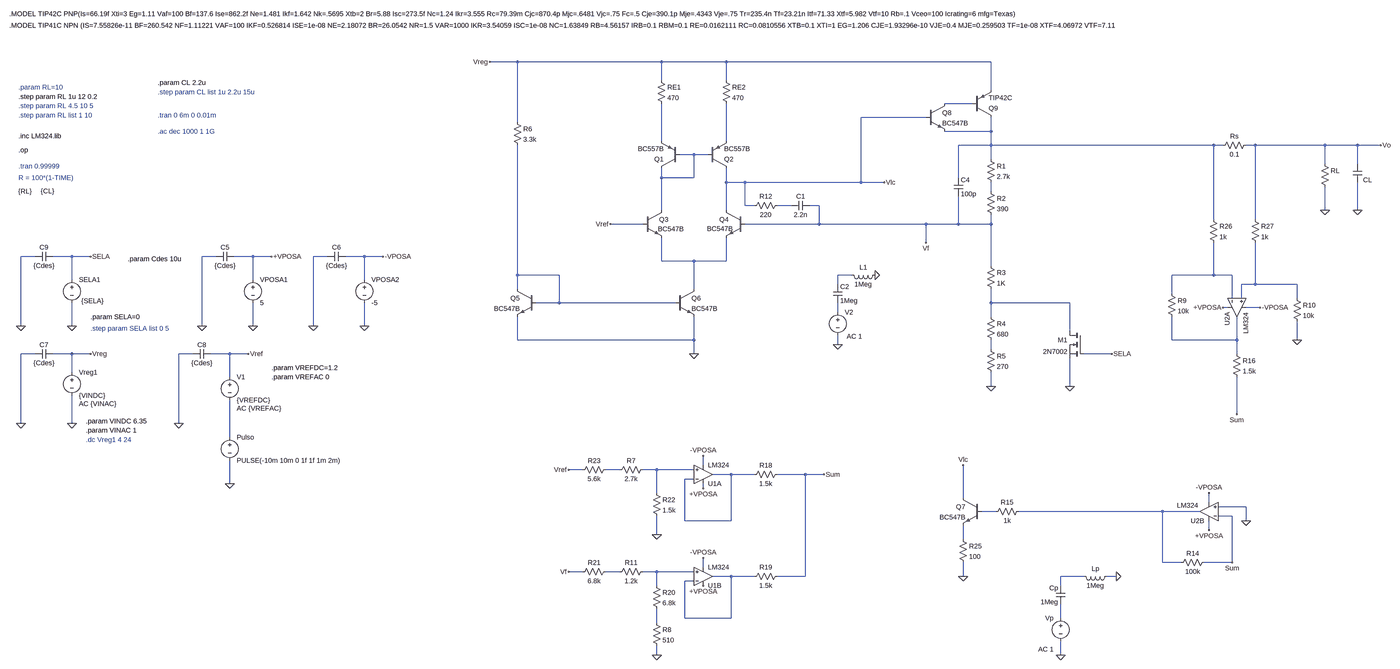
[diagram p0: schematic Simulación.asc, whole sheet]
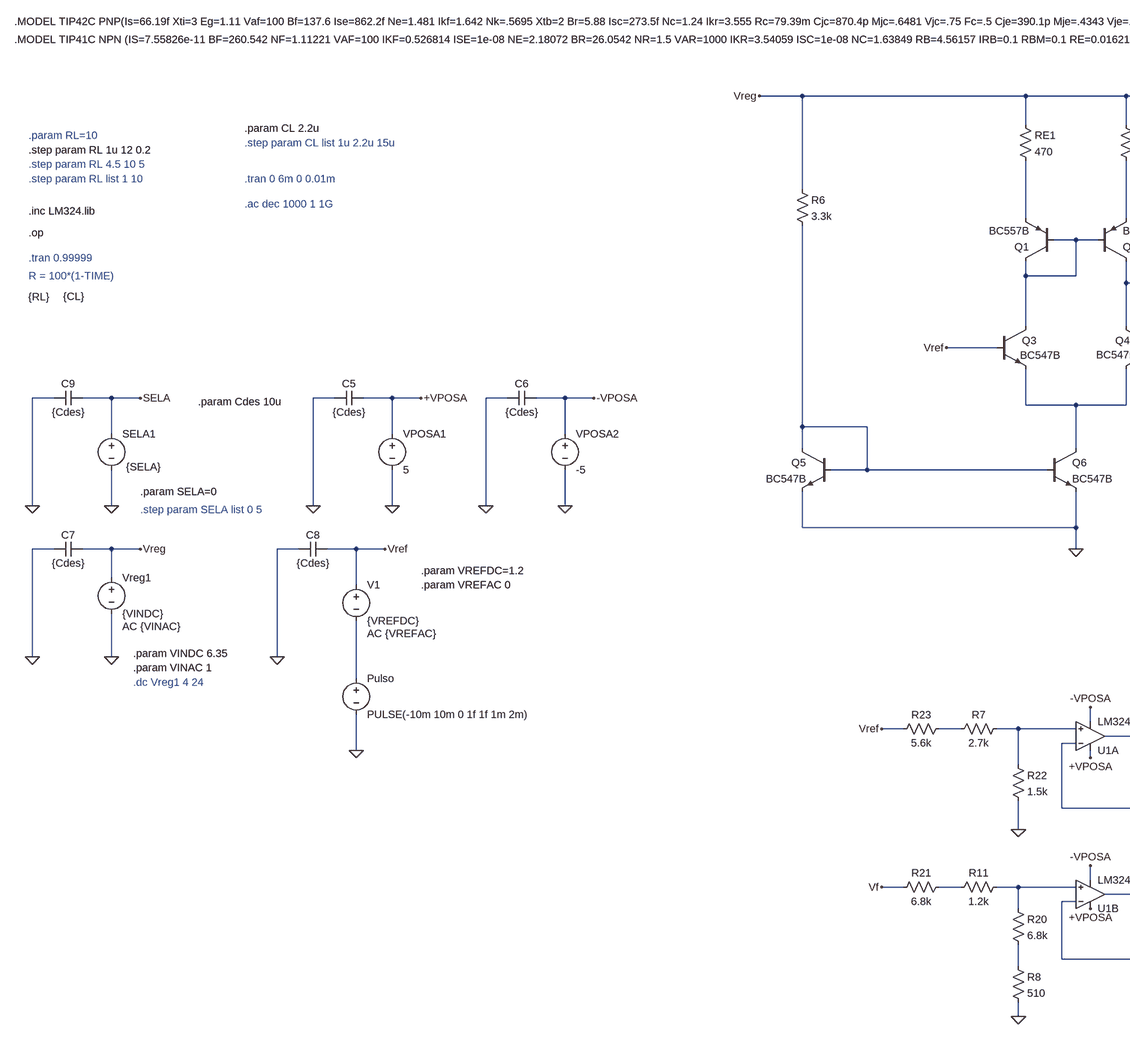
[diagram p1: schematic Simulación.asc, part, row 1 of 1, column 1 of 2]
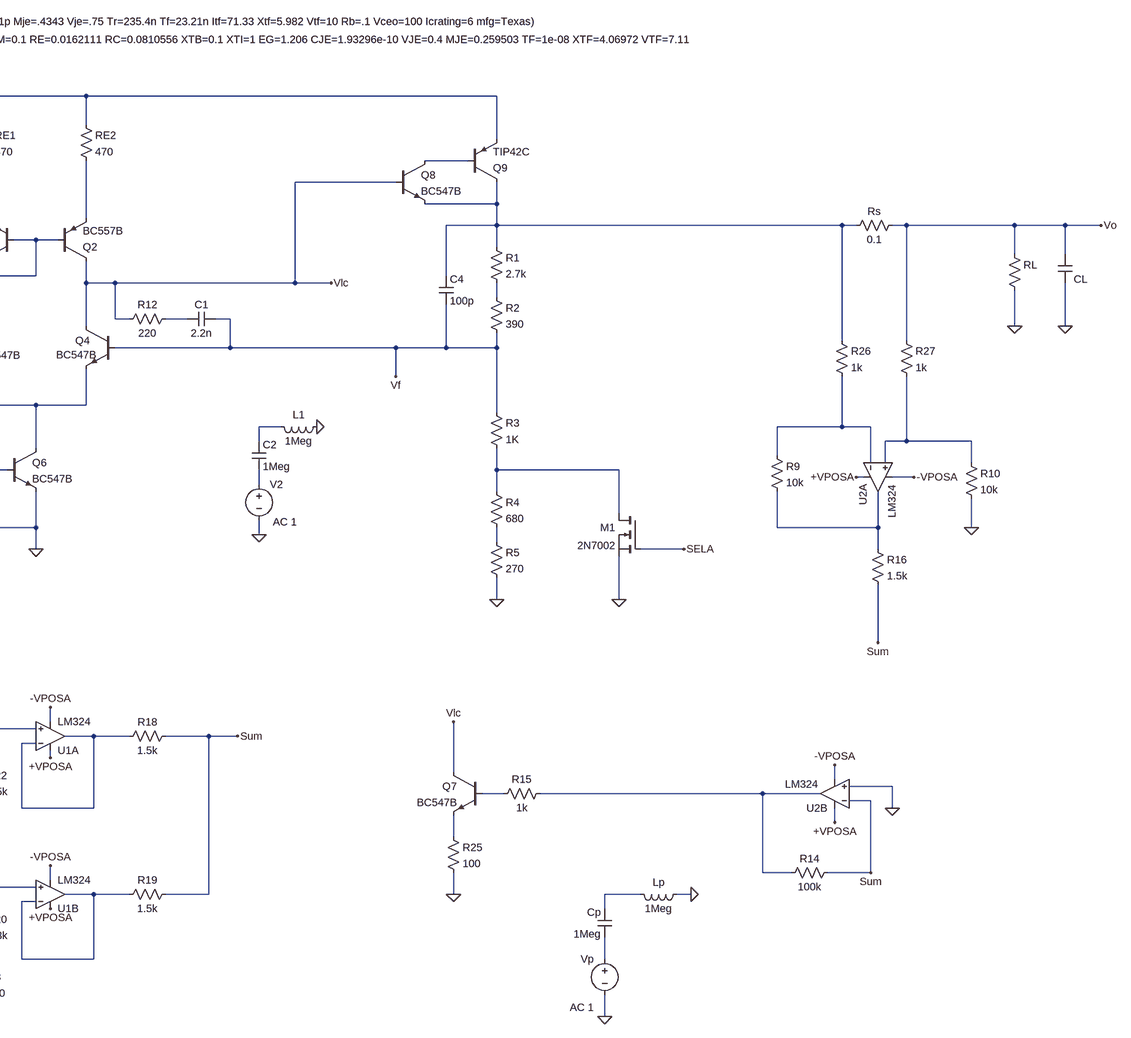
[diagram p2: schematic Simulación.asc, part, row 1 of 1, column 2 of 2]
Simulación.asc, the LTspice schematic file:
Version 4
SHEET 1 10276 2836
WIRE -160 -288 -256 -288
WIRE 336 -288 -160 -288
WIRE 560 -288 336 -288
WIRE 1472 -288 560 -288
WIRE 336 -224 336 -288
WIRE 560 -224 560 -288
WIRE 1472 -192 1472 -288
WIRE 1408 -144 1312 -144
WIRE 1248 -96 1024 -96
WIRE -160 -80 -160 -288
WIRE 1472 -48 1472 -96
WIRE 1472 -48 1312 -48
WIRE 336 -16 336 -144
WIRE 560 -16 560 -144
WIRE 1472 0 1472 -48
WIRE 1472 0 1360 0
WIRE 2336 0 1472 0
WIRE 2368 0 2336 0
WIRE 2480 0 2448 0
WIRE 2720 0 2480 0
WIRE 2832 0 2720 0
WIRE 2912 0 2832 0
WIRE 448 32 400 32
WIRE 496 32 448 32
WIRE 1472 48 1472 0
WIRE 2720 64 2720 0
WIRE 2832 64 2832 0
WIRE 336 112 336 80
WIRE 448 112 448 32
WIRE 448 112 336 112
WIRE 1360 112 1360 0
WIRE 560 128 560 80
WIRE 624 128 560 128
WIRE 1024 128 1024 -96
WIRE 1024 128 624 128
WIRE 1104 128 1024 128
WIRE 1472 160 1472 128
WIRE 624 208 624 128
WIRE 656 208 624 208
WIRE 784 208 736 208
WIRE 880 208 848 208
WIRE 336 224 336 112
WIRE 560 224 560 128
WIRE 2720 224 2720 144
WIRE 2832 224 2832 128
WIRE 2336 256 2336 0
WIRE 2480 256 2480 0
WIRE 272 272 160 272
WIRE 880 272 880 208
WIRE 880 272 624 272
WIRE 1248 272 880 272
WIRE 1360 272 1360 176
WIRE 1360 272 1248 272
WIRE 1472 272 1472 240
WIRE 1472 272 1360 272
WIRE 1248 336 1248 272
WIRE -1824 384 -1872 384
WIRE -1696 384 -1760 384
WIRE -1632 384 -1696 384
WIRE -1200 384 -1248 384
WIRE -1072 384 -1136 384
WIRE -1008 384 -1072 384
WIRE -816 384 -864 384
WIRE -688 384 -752 384
WIRE -624 384 -688 384
WIRE 336 400 336 320
WIRE 448 400 336 400
WIRE 560 400 560 320
WIRE 560 400 448 400
WIRE 1472 416 1472 272
WIRE -160 448 -160 0
WIRE -16 448 -160 448
WIRE 992 448 944 448
WIRE 2336 448 2336 336
WIRE 2336 448 2192 448
WIRE 2400 448 2336 448
WIRE -1696 464 -1696 384
WIRE -1072 464 -1072 384
WIRE -688 464 -688 384
WIRE 944 480 944 448
WIRE 2480 480 2480 336
WIRE 2480 480 2432 480
WIRE 2624 480 2480 480
WIRE -160 496 -160 448
WIRE 448 496 448 400
WIRE 2192 512 2192 448
WIRE 2400 528 2400 448
WIRE 2432 528 2432 480
WIRE 2624 528 2624 480
WIRE -16 544 -16 448
WIRE -16 544 -96 544
WIRE 384 544 -16 544
WIRE 1472 544 1472 496
WIRE 1744 544 1472 544
WIRE 2384 560 2368 560
WIRE 2496 560 2448 560
WIRE 944 576 944 544
WIRE 1472 592 1472 544
WIRE -1872 624 -1872 384
WIRE -1696 624 -1696 544
WIRE -1248 624 -1248 384
WIRE -1072 624 -1072 544
WIRE -864 624 -864 384
WIRE -688 624 -688 544
WIRE 1744 640 1744 544
WIRE -160 672 -160 592
WIRE 448 672 448 592
WIRE 448 672 -160 672
WIRE 2192 672 2192 592
WIRE 2416 672 2416 592
WIRE 2416 672 2192 672
WIRE 2624 672 2624 608
WIRE 944 688 944 656
WIRE 1472 704 1472 672
WIRE -1824 720 -1872 720
WIRE -1696 720 -1760 720
WIRE -1632 720 -1696 720
WIRE -1280 720 -1328 720
WIRE -1152 720 -1216 720
WIRE -1088 720 -1152 720
WIRE 448 720 448 672
WIRE 1888 720 1792 720
WIRE 2416 720 2416 672
WIRE -1696 784 -1696 720
WIRE -1152 800 -1152 720
WIRE 1472 832 1472 784
WIRE 1744 832 1744 736
WIRE 2416 928 2416 800
WIRE -1872 960 -1872 720
WIRE -1696 960 -1696 864
WIRE -1328 960 -1328 720
WIRE -1152 1008 -1152 880
WIRE 480 1104 480 1072
WIRE 64 1120 16 1120
WIRE 192 1120 144 1120
WIRE 320 1120 272 1120
WIRE 448 1120 320 1120
WIRE 576 1136 512 1136
WIRE 656 1136 576 1136
WIRE 832 1136 736 1136
WIRE 896 1136 832 1136
WIRE 448 1152 416 1152
WIRE -1152 1168 -1152 1088
WIRE 480 1184 480 1168
WIRE 320 1200 320 1120
WIRE 1376 1216 1376 1104
WIRE 2320 1232 2320 1200
WIRE 2448 1248 2352 1248
WIRE 1488 1264 1440 1264
WIRE 2160 1264 1568 1264
WIRE 2288 1264 2160 1264
WIRE 2400 1280 2352 1280
WIRE 416 1296 416 1152
WIRE 576 1296 576 1136
WIRE 576 1296 416 1296
WIRE 2448 1296 2448 1248
WIRE 2320 1328 2320 1296
WIRE 320 1344 320 1280
WIRE 1376 1360 1376 1312
WIRE 2160 1440 2160 1264
WIRE 2224 1440 2160 1440
WIRE 2400 1440 2400 1280
WIRE 2400 1440 2304 1440
WIRE 480 1456 480 1424
WIRE 64 1472 16 1472
WIRE 192 1472 144 1472
WIRE 320 1472 272 1472
WIRE 448 1472 320 1472
WIRE 576 1488 512 1488
WIRE 656 1488 576 1488
WIRE 832 1488 832 1136
WIRE 832 1488 736 1488
WIRE 1376 1488 1376 1440
WIRE 1792 1488 1712 1488
WIRE 1904 1488 1872 1488
WIRE 448 1504 416 1504
WIRE 320 1520 320 1472
WIRE 1712 1520 1712 1488
WIRE 416 1632 416 1504
WIRE 576 1632 576 1488
WIRE 576 1632 416 1632
WIRE 1712 1632 1712 1584
WIRE 320 1648 320 1600
WIRE 320 1760 320 1728
WIRE 1712 1760 1712 1712
FLAG 1248 336 Vf
FLAG 1376 1488 0
FLAG 320 1344 0
FLAG 320 1760 0
FLAG 2720 224 0
FLAG 2832 224 0
FLAG 480 1184 +VPOSA
FLAG 2368 560 +VPOSA
FLAG 2320 1328 +VPOSA
FLAG 480 1520 +VPOSA
FLAG -1696 960 0
FLAG 1744 832 0
FLAG 1472 832 0
FLAG -1696 624 0
FLAG 448 720 0
FLAG -1072 624 0
FLAG -1008 384 +VPOSA
FLAG 160 272 Vref
FLAG 16 1472 Vf
FLAG 16 1120 Vref
FLAG 2400 1440 Sum
FLAG 1376 1104 Vlc
FLAG 1104 128 Vlc
FLAG 896 1136 Sum
FLAG -256 -288 Vreg
FLAG -1632 720 Vreg
FLAG 1888 720 SELA
FLAG -1632 384 SELA
FLAG 2912 0 Vo
FLAG 2416 928 Sum
FLAG -688 624 0
FLAG -624 384 -VPOSA
FLAG 2624 672 0
FLAG 2496 560 -VPOSA
FLAG 480 1072 -VPOSA
FLAG 480 1424 -VPOSA
FLAG 2320 1200 -VPOSA
FLAG 2448 1296 0
FLAG 1712 1760 0
FLAG -1088 720 Vref
FLAG -1152 1168 0
FLAG 944 688 0
FLAG -1248 624 0
FLAG -864 624 0
FLAG -1872 960 0
FLAG -1328 960 0
FLAG -1872 624 0
FLAG 1072 448 0
FLAG 1904 1488 0
SYMBOL pnp 400 80 R180
SYMATTR InstName Q1
SYMATTR Value BC557B
SYMBOL pnp 496 80 M180
SYMATTR InstName Q2
SYMATTR Value BC557B
SYMBOL npn 272 224 R0
WINDOW 3 52 65 Left 2
SYMATTR Value BC547B
SYMATTR InstName Q3
SYMBOL npn 624 224 M0
WINDOW 3 42 64 Left 2
SYMATTR Value BC547B
SYMATTR InstName Q4
SYMBOL pnp 1408 -96 M180
SYMATTR InstName Q9
SYMATTR Value TIP42C
SYMBOL npn 1248 -144 R0
SYMATTR InstName Q8
SYMATTR Value BC547B
SYMBOL res 1456 144 R0
SYMATTR InstName R2
SYMATTR Value 390
SYMBOL res 1456 400 R0
SYMATTR InstName R3
SYMATTR Value 1K
SYMBOL res 2704 48 R0
WINDOW 3 -4585 111 Left 2
SYMATTR Value {RL}
SYMATTR InstName RL
SYMBOL voltage -1152 784 R0
WINDOW 123 24 124 Left 2
WINDOW 39 0 0 Left 0
SYMATTR Value2 AC {VREFAC}
SYMATTR InstName V1
SYMATTR Value {VREFDC}
SYMBOL voltage -1696 768 R0
WINDOW 123 24 124 Left 2
WINDOW 39 0 0 Left 0
SYMATTR Value2 AC {VINAC}
SYMATTR InstName Vreg1
SYMATTR Value {VINDC}
SYMBOL res 320 -240 R0
SYMATTR InstName RE1
SYMATTR Value 470
SYMBOL res 544 -240 R0
SYMATTR InstName RE2
SYMATTR Value 470
SYMBOL cap 2816 64 R0
WINDOW 0 35 56 Left 2
WINDOW 3 -4620 94 Left 2
SYMATTR InstName CL
SYMATTR Value {CL}
SYMBOL res 2464 -16 R90
WINDOW 0 0 56 VBottom 2
WINDOW 3 32 56 VTop 2
SYMATTR InstName Rs
SYMATTR Value 0.1
SYMBOL res 2320 1424 R90
WINDOW 0 0 56 VBottom 2
WINDOW 3 32 56 VTop 2
SYMATTR InstName R14
SYMATTR Value 100k
SYMBOL res 1584 1248 R90
WINDOW 0 0 56 VBottom 2
WINDOW 3 32 56 VTop 2
SYMATTR InstName R15
SYMATTR Value 1k
SYMBOL res 1360 1344 R0
SYMATTR InstName R25
SYMATTR Value 100
SYMBOL npn 1440 1216 M0
SYMATTR InstName Q7
SYMATTR Value BC547B
SYMBOL res 304 1184 R0
SYMATTR InstName R22
SYMATTR Value 1.5k
SYMBOL res 752 1120 R90
WINDOW 0 0 56 VBottom 2
WINDOW 3 32 56 VTop 2
SYMATTR InstName R18
SYMATTR Value 1.5k
SYMBOL res 160 1456 R90
WINDOW 0 0 56 VBottom 2
WINDOW 3 32 56 VTop 2
SYMATTR InstName R21
SYMATTR Value 6.8k
SYMBOL res 304 1504 R0
SYMATTR InstName R20
SYMATTR Value 6.8k
SYMBOL res 752 1472 R90
WINDOW 0 0 56 VBottom 2
WINDOW 3 32 56 VTop 2
SYMATTR InstName R19
SYMATTR Value 1.5k
SYMBOL res 1456 576 R0
SYMATTR InstName R4
SYMATTR Value 680
SYMBOL nmos 1792 640 M0
SYMATTR InstName M1
SYMATTR Value 2N7002
SYMBOL voltage -1696 448 R0
WINDOW 3 32 89 Left 2
WINDOW 123 0 0 Left 0
WINDOW 39 0 0 Left 0
SYMATTR Value {SELA}
SYMATTR InstName SELA1
SYMBOL npn 384 496 R0
SYMATTR InstName Q6
SYMATTR Value BC547B
SYMBOL npn -96 496 M0
SYMATTR InstName Q5
SYMATTR Value BC547B
SYMBOL res -176 -96 R0
SYMATTR InstName R6
SYMATTR Value 3.3k
SYMBOL res 1456 32 R0
SYMATTR InstName R1
SYMATTR Value 2.7k
SYMBOL OpAmps\\opamp2 2352 560 M90
SYMATTR InstName U2A
SYMATTR Value LM324
SYMBOL OpAmps\\opamp2 2320 1328 R180
WINDOW 3 36 85 Left 2
SYMATTR Value LM324
SYMATTR InstName U2B
SYMBOL OpAmps\\opamp2 480 1200 M180
SYMATTR InstName U1A
SYMATTR Value LM324
SYMBOL voltage -1072 448 R0
SYMATTR InstName VPOSA1
SYMATTR Value 5
SYMBOL res 160 1104 R90
WINDOW 0 0 56 VBottom 2
WINDOW 3 32 56 VTop 2
SYMATTR InstName R23
SYMATTR Value 5.6k
SYMBOL res 2608 512 R0
SYMATTR InstName R10
SYMATTR Value 10k
SYMBOL res 2320 240 R0
SYMATTR InstName R26
SYMATTR Value 1k
SYMBOL res 2464 240 R0
SYMATTR InstName R27
SYMATTR Value 1k
SYMBOL res 1456 688 R0
SYMATTR InstName R5
SYMATTR Value 270
SYMBOL OpAmps\\opamp2 480 1552 M180
SYMATTR InstName U1B
SYMATTR Value LM324
SYMBOL res 288 1104 R90
WINDOW 0 0 56 VBottom 2
WINDOW 3 32 56 VTop 2
SYMATTR InstName R7
SYMATTR Value 2.7k
SYMBOL voltage -1152 992 R0
WINDOW 123 0 0 Left 0
WINDOW 39 0 0 Left 0
SYMATTR InstName Pulso
SYMATTR Value PULSE(-10m 10m 0 1f 1f 1m 2m)
SYMBOL res 2400 704 R0
SYMATTR InstName R16
SYMATTR Value 1.5k
SYMBOL voltage -688 448 R0
SYMATTR InstName VPOSA2
SYMATTR Value -5
SYMBOL res 2176 496 R0
SYMATTR InstName R9
SYMATTR Value 10k
SYMBOL res 304 1632 R0
SYMATTR InstName R8
SYMATTR Value 510
SYMBOL res 288 1456 R90
WINDOW 0 0 56 VBottom 2
WINDOW 3 32 56 VTop 2
SYMATTR InstName R11
SYMATTR Value 1.2k
SYMBOL cap 1728 1520 M0
SYMATTR InstName Cp
SYMATTR Value 1Meg
SYMBOL voltage 1712 1616 M0
WINDOW 123 24 124 Left 2
WINDOW 39 0 0 Left 0
WINDOW 3 24 44 Left 2
SYMATTR Value2 AC 1
SYMATTR Value ""
SYMATTR InstName Vp
SYMBOL ind 1776 1472 M90
WINDOW 0 5 56 VBottom 2
WINDOW 3 32 56 VTop 2
SYMATTR InstName Lp
SYMATTR Value 1Meg
SYMBOL cap 1344 112 R0
SYMATTR InstName C4
SYMATTR Value 100p
SYMBOL cap 848 192 R90
WINDOW 0 0 32 VBottom 2
WINDOW 3 32 32 VTop 2
SYMATTR InstName C1
SYMATTR Value 2.2n
SYMBOL res 752 192 R90
WINDOW 0 0 56 VBottom 2
WINDOW 3 32 56 VTop 2
SYMATTR InstName R12
SYMATTR Value 220
SYMBOL ind 1088 432 R90
WINDOW 0 5 56 VBottom 2
WINDOW 3 32 56 VTop 2
SYMATTR InstName L1
SYMATTR Value 1Meg
SYMBOL cap 928 480 R0
SYMATTR InstName C2
SYMATTR Value 1Meg
SYMBOL voltage 944 560 R0
WINDOW 3 24 152 Left 2
WINDOW 123 31 100 Left 2
WINDOW 39 0 0 Left 0
SYMATTR Value ""
SYMATTR Value2 AC 1
SYMATTR InstName V2
SYMBOL cap -1200 400 R270
WINDOW 0 32 32 VTop 2
WINDOW 3 0 32 VBottom 2
SYMATTR InstName C5
SYMATTR Value {Cdes}
SYMBOL cap -816 400 R270
WINDOW 0 32 32 VTop 2
WINDOW 3 0 32 VBottom 2
SYMATTR InstName C6
SYMATTR Value {Cdes}
SYMBOL cap -1824 736 R270
WINDOW 0 32 32 VTop 2
WINDOW 3 0 32 VBottom 2
SYMATTR InstName C7
SYMATTR Value {Cdes}
SYMBOL cap -1280 736 R270
WINDOW 0 32 32 VTop 2
WINDOW 3 0 32 VBottom 2
SYMATTR InstName C8
SYMATTR Value {Cdes}
SYMBOL cap -1824 400 R270
WINDOW 0 32 32 VTop 2
WINDOW 3 0 32 VBottom 2
SYMATTR InstName C9
SYMATTR Value {Cdes}
TEXT -1880 16 Left 2 !.op
TEXT -1648 952 Left 2 !.param VINDC 6.35
TEXT -1648 984 Left 2 !.param VINAC 1
TEXT -1008 768 Left 2 !.param VREFDC=1.2
TEXT -1008 800 Left 2 !.param VREFAC 0
TEXT -1880 -200 Left 2 ;.param RL=10
TEXT -1648 1016 Left 2 ;.dc Vreg1 4 24
TEXT -1880 -168 Left 2 !.step param RL 1u 12 0.2
TEXT -1912 -544 Left 2 !.MODEL TIP42C PNP(Is=66.19f Xti=3 Eg=1.11 Vaf=100 Bf=137.6 Ise=862.2f Ne=1.481 Ikf=1.642 Nk=.5695 Xtb=2 Br=5.88 Isc=273.5f Nc=1.24 Ikr=3.555 Rc=79.39m Cjc=870.4p Mjc=.6481 Vjc=.75 Fc=.5 Cje=390.1p Mje=.4343 Vje=.75 Tr=235.4n Tf=23.21n Itf=71.33 Xtf=5.982 Vtf=10 Rb=.1 Vceo=100 Icrating=6 mfg=Texas)
TEXT -1912 -504 Left 2 !.MODEL TIP41C NPN (IS=7.55826e-11 BF=260.542 NF=1.11221 VAF=100 IKF=0.526814 ISE=1e-08 NE=2.18072 BR=26.0542 NR=1.5 VAR=1000 IKR=3.54059 ISC=1e-08 NC=1.63849 RB=4.56157 IRB=0.1 RBM=0.1 RE=0.0162111 RC=0.0810556 XTB=0.1 XTI=1 EG=1.206 CJE=1.93296e-10 VJE=0.4 MJE=0.259503 TF=1e-08 XTF=4.06972 VTF=7.1157 ITF=0.001 CJC=1.09657e-10 VJC=0.730921 MJC=0.23 XCJC=0.803085 FC=0.8 TR=9.01013e-08 PTF=0 Vceo=100 ICrating=6 mfg=ON_Semi)
TEXT -1880 -32 Left 2 !.inc LM324.lib
TEXT -1880 72 Left 2 ;.tran 0.99999
TEXT -1880 112 Left 2 ;R = 100*(1-TIME)
TEXT -1632 592 Left 2 !.param SELA=0
TEXT -1400 -48 Left 2 ;.ac dec 1000 1 1G
TEXT -1880 -104 Left 2 ;.step param RL list 1 10
TEXT -1632 632 Left 2 ;.step param SELA list 0 5
TEXT -1400 -104 Left 2 ;.tran 0 6m 0 0.01m
TEXT -1400 -184 Left 2 ;.step param CL list 1u 2.2u 15u
TEXT -1400 -216 Left 2 !.param CL 2.2u
TEXT -1504 392 Left 2 !.param Cdes 10u
TEXT -1880 -136 Left 2 ;.step param RL 4.5 10 5

The netlist it stands for:
* Simulación.asc
Q1 N005 N005 N003 0 BC557B
Q2 Vlc N005 N004 0 BC557B
Q3 N005 Vref N008 0 BC547B
Q4 Vlc Vf N008 0 BC547B
Q9 N002 N001 Vreg 0 TIP42C
Q8 N001 Vlc N002 0 BC547B
R2 N006 Vf 390
R3 Vf N013 1K
RL Vo 0 {RL}
V1 Vref N017 {VREFDC} AC {VREFAC}
Vreg1 Vreg 0 {VINDC} AC {VINAC}
RE1 Vreg N003 470
RE2 Vreg N004 470
CL Vo 0 {CL}
Rs Vo N002 0.1
R14 Sum N022 100k
R15 N022 N021 1k
R25 N023 0 100
Q7 Vlc N021 N023 0 BC547B
R22 N019 0 1.5k
R18 Sum N020 1.5k
R21 N024 Vf 6.8k
R20 N025 N029 6.8k
R19 Sum N026 1.5k
R4 N013 N016 680
M1 N013 SELA 0 0 2N7002
V§SELA1 SELA 0 {SELA}
Q6 N008 N009 0 0 BC547B
Q5 N009 N009 0 0 BC547B
R6 Vreg N009 3.3k
R1 N002 N006 2.7k
XU2A N012 N011 +VPOSA -VPOSA N015 LM324  ; pins In+ In- V+ V- OUT
XU2B 0 Sum +VPOSA -VPOSA N022 LM324  ; pins In+ In- V+ V- OUT
XU1A N019 N020 +VPOSA -VPOSA N020 LM324  ; pins In+ In- V+ V- OUT
VPOSA1 +VPOSA 0 5
R23 N018 Vref 5.6k
R10 N012 0 10k
R26 N002 N011 1k
R27 Vo N012 1k
R5 N016 0 270
XU1B N025 N026 +VPOSA -VPOSA N026 LM324  ; pins In+ In- V+ V- OUT
R7 N019 N018 2.7k
V§Pulso N017 0 PULSE(-10m 10m 0 1f 1f 1m 2m)
R16 N015 Sum 1.5k
VPOSA2 -VPOSA 0 -5
R9 N011 N015 10k
R8 N029 0 510
R11 N025 N024 1.2k
Cp N027 N028 1Meg
Vp N028 0 AC 1
Lp N027 0 1Meg
C4 N002 Vf 100p
C1 Vf N007 2.2n
R12 N007 Vlc 220
L1 0 N010 1Meg
C2 N010 N014 1Meg
V2 N014 0 AC 1
C5 0 +VPOSA {Cdes}
C6 0 -VPOSA {Cdes}
C7 0 Vreg {Cdes}
C8 0 Vref {Cdes}
C9 0 SELA {Cdes}
.model NPN NPN
.model PNP PNP
.lib standard.bjt
.model NMOS NMOS
.model PMOS PMOS
.lib standard.mos
.op
.param VINDC 6.35
.param VINAC 1
.param VREFDC=1.2
.param VREFAC 0
* .param RL=10
* .dc Vreg1 4 24
.step param RL 1u 12 0.2
.MODEL TIP42C PNP(Is=66.19f Xti=3 Eg=1.11 Vaf=100 Bf=137.6 Ise=862.2f Ne=1.481 Ikf=1.642 Nk=.5695 Xtb=2 Br=5.88 Isc=273.5f Nc=1.24 Ikr=3.555 Rc=79.39m Cjc=870.4p Mjc=.6481 Vjc=.75 Fc=.5 Cje=390.1p Mje=.4343 Vje=.75 Tr=235.4n Tf=23.21n Itf=71.33 Xtf=5.982 Vtf=10 Rb=.1 Vceo=100 Icrating=6 mfg=Texas)
.MODEL TIP41C NPN (IS=7.55826e-11 BF=260.542 NF=1.11221 VAF=100 IKF=0.526814 ISE=1e-08 NE=2.18072 BR=26.0542 NR=1.5 VAR=1000 IKR=3.54059 ISC=1e-08 NC=1.63849 RB=4.56157 IRB=0.1 RBM=0.1 RE=0.0162111 RC=0.0810556 XTB=0.1 XTI=1 EG=1.206 CJE=1.93296e-10 VJE=0.4 MJE=0.259503 TF=1e-08 XTF=4.06972 VTF=7.1157 ITF=0.001 CJC=1.09657e-10 VJC=0.730921 MJC=0.23 XCJC=0.803085 FC=0.8 TR=9.01013e-08 PTF=0 Vceo=100 ICrating=6 mfg=ON_Semi)
.inc LM324.lib
* .tran 0.99999
* R = 100*(1-TIME)
.param SELA=0
* .ac dec 1000 1 1G
* .step param RL list 1 10
* .step param SELA list 0 5
* .tran 0 6m 0 0.01m
* .step param CL list 1u 2.2u 15u
.param CL 2.2u
.param Cdes 10u
* .step param RL 4.5 10 5
.backanno
.end